# Altium schematic sheet Keyboard_Joy.SchDoc
size A4
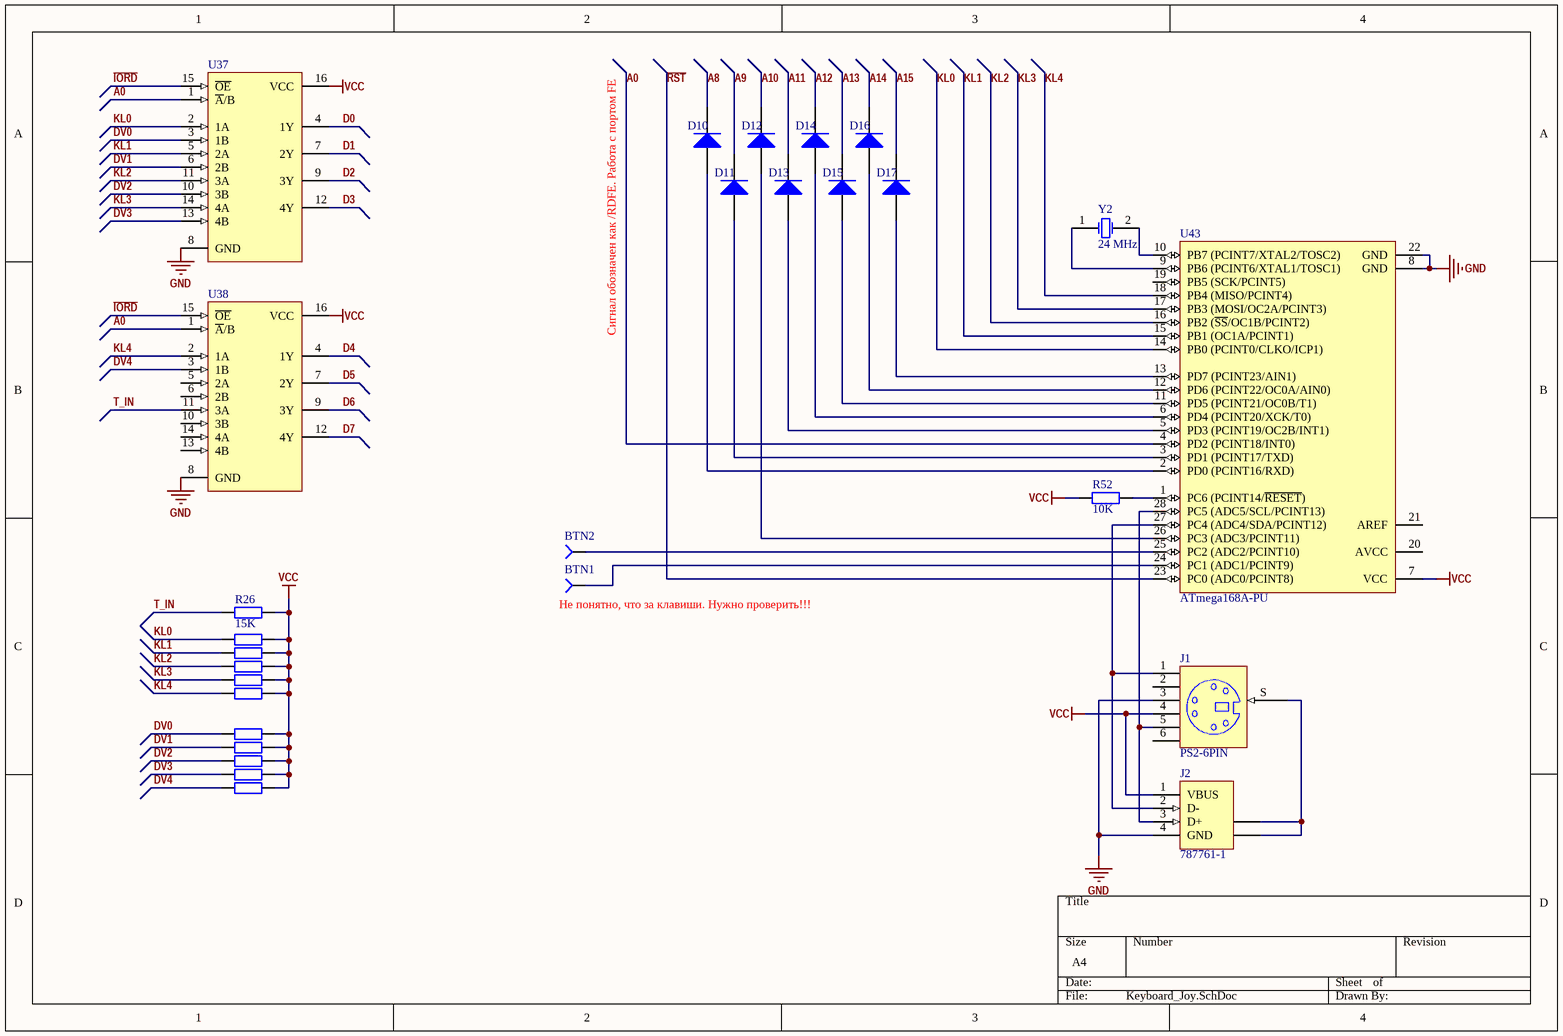
[diagram p0: Keyboard_Joy.SchDoc]

## Parts
BTN1  Socket  [PIN1]  (value not drawn)
BTN2  Socket  [PIN1]  (value not drawn)
D10  Diode 1N4148  [DO-35]  (value not drawn)
D11  Diode 1N4148  [DO-35]  (value not drawn)
D12  Diode 1N4148  [DO-35]  (value not drawn)
D13  Diode 1N4148  [DO-35]  (value not drawn)
D14  Diode 1N4148  [DO-35]  (value not drawn)
D15  Diode 1N4148  [DO-35]  (value not drawn)
D16  Diode 1N4148  [DO-35]  (value not drawn)
D17  Diode 1N4148  [DO-35]  (value not drawn)
J1  PS2-6PIN  [PS2-6PIN]
J2  787761-1  [787761]
R26  value 15K  [AXIAL-0.4]  (hidden comment: Res2)
R27  Res2  [AXIAL-0.4]  (value not drawn)
R28  Res2  [AXIAL-0.4]  (value not drawn)
R29  Res2  [AXIAL-0.4]  (value not drawn)
R30  Res2  [AXIAL-0.4]  (value not drawn)
R33  Res2  [AXIAL-0.4]  (value not drawn)
R36  Res2  [AXIAL-0.4]  (value not drawn)
R38  Res2  [AXIAL-0.4]  (value not drawn)
R40  Res2  [AXIAL-0.4]  (value not drawn)
R42  Res2  [AXIAL-0.4]  (value not drawn)
R44  Res2  [AXIAL-0.4]  (value not drawn)
R52  value 10K  [AXIAL-0.4]  (hidden comment: Res2)
U37  (no value)  [N016]
U38  (no value)  [N016]
U43  ATmega168A-PU  [28P3]
Y2  24 MHz  [HC25U]

## Nets
GND: J1.3 J2.4(GND) U37.8(GND) U38.8(GND) U43.8(GND) U43.22(GND)
VCC: J1.4 J2.1(VBUS) R26.2 R27.2 R28.2 R29.2 R30.2 R33.2 R36.2 R38.2 R40.2 R42.2 R44.2 R52.2 U37.16(VCC) U38.16(VCC) U43.7(VCC)
A0: U37.1(~{A}/B) U38.1(~{A}/B) U43.4(PD2_(PCINT18/INT0))
A8: D10.2(K)
A9: D11.2(K)
A10: D12.2(K)
A11: D13.2(K)
A12: D14.2(K)
A13: D15.2(K)
A14: D16.2(K)
A15: D17.2(K)
D0: U37.4(1Y)
D1: U37.7(2Y)
D2: U37.9(3Y)
D3: U37.12(4Y)
D4: U38.4(1Y)
D5: U38.7(2Y)
D6: U38.9(3Y)
D7: U38.12(4Y)
DV0: R36.1 U37.3(1B)
DV1: R38.1 U37.6(2B)
DV2: R40.1 U37.10(3B)
DV3: R42.1 U37.13(4B)
DV4: R44.1 U38.3(1B)
~{IORD}: U37.15(~{OE}) U38.15(~{OE})
KL0: R27.1 U37.2(1A) U43.14(PB0_(PCINT0/CLKO/ICP1))
KL1: R28.1 U37.5(2A) U43.15(PB1_(OC1A/PCINT1))
KL2: R29.1 U37.11(3A) U43.16(PB2_(~{SS}/OC1B/PCINT2))
KL3: R30.1 U37.14(4A) U43.17(PB3_(MOSI/OC2A/PCINT3))
KL4: R33.1 U38.2(1A) U43.18(PB4_(MISO/PCINT4))
~{RST}: U43.23(PC0_(ADC0/PCINT8))
T_IN: R26.1 U38.11(3A)
NetBTN1_1: BTN1.1 U43.24(PC1_(ADC1/PCINT9))
NetBTN2_1: BTN2.1 U43.25(PC2_(ADC2/PCINT10))
NetD10_1: D10.1(A) U43.2(PD0_(PCINT16/RXD))
NetD11_1: D11.1(A) U43.3(PD1_(PCINT17/TXD))
NetD12_1: D12.1(A) U43.26(PC3_(ADC3/PCINT11))
NetD13_1: D13.1(A) U43.5(PD3_(PCINT19/OC2B/INT1))
NetD14_1: D14.1(A) U43.6(PD4_(PCINT20/XCK/T0))
NetD15_1: D15.1(A) U43.11(PD5_(PCINT21/OC0B/T1))
NetD16_1: D16.1(A) U43.12(PD6_(PCINT22/OC0A/AIN0))
NetD17_1: D17.1(A) U43.13(PD7_(PCINT23/AIN1))
NetJ1_1: J1.1 J2.2(D-) U43.27(PC4_(ADC4/SDA/PCINT12))
NetJ1_5: J1.5 J2.3(D+) U43.28(PC5_(ADC5/SCL/PCINT13))
NetJ1_S: J1.S J2.5(SHLD) J2.6(SHLD)
NetR52_1: R52.1 U43.1(PC6_(PCINT14/~{RESET}))
NetU43_9: U43.9(PB6_(PCINT6/XTAL1/TOSC1)) Y2.1(OSC1)
NetU43_10: U43.10(PB7_(PCINT7/XTAL2/TOSC2)) Y2.2(OSC2)

Not connected (* = marked no-connect by the designer): J1 2 6; U38 5(2A) 6(2B) 10(3B) 13(4B) 14(4A); U43 19(PB5_(SCK/PCINT5)) 20(AVCC) 21(AREF)

## Notes on the sheet
- Сигнал обозначен как /RDFE. Работа с портом FE
- (near BTN1) Не понятно, что за клавиши. Нужно проверить!!!

## Library data of the parts
D10-D17 = Diode 1N4148: High Conductance Fast Diode; Published: 8-Jun-2000; LatestRevisionDate: 17-Jul-2002; LatestRevisionNote: Re-released for DXP Platform.; DatasheetVersion: 1997; PackageReference: DO-35; Publisher: Altium Limited; PackageDescription: Diode, Axial; Body 3.8 x 1.9 mm (LxDia. max), Lead Dia. 0.53 mm (max); Code_JEDEC: DO-204-AH; ComponentLink1Description: Manufacturer Link; ComponentLink1URL: http://www.fairchildsemi.com/; ComponentLink2Description: Datasheet; ComponentLink2URL: http://www.fairchildsemi.com/ds/1N%2F1N4148.pdf
J1 = PS2-6PIN: 6 Pin Through Hole PS2 Socket (Kycon P/N); Published: 17-Dec-2003; Publisher: Altium Limited; ComponentLink1Description: Manufacturer Link; ComponentLink1URL: http://www.oupiin.com/prodindx.html#Headers
J2 = 787761-1: USB 1.1, Right Angle, Thru-Hole, A Type, Receptacle, 4 Position, Black; ContactMaterial: Copper Alloy; ContactPlating: Gold Flash over Palladium Nickel or Gold (30) over Nickel; TerminationLength: 2.84mm [0.112in.]; PCB_Layout: Complies with manufacturer's recommendation.; DrillSize: Corresponds to nominal value.; PanelGround: Without; Published: 15-Jul-2004; DatasheetDocument: 11-Jan-2004; PackageDocument: 11-Jan-2004; PackageReference: 787761; Publisher: Altium Limited; HousingMaterial: Thermoplastic; ComponentLink1Description: Manufacturer Link; ComponentLink1URL: http://www.tycoelectronics.com/; ComponentLink2Description: Packaging Specification; ComponentLink2URL: http://ecommas.tycoelectronics.com/commerce/DocumentDelivery/DDEController?Action=showdoc&DocId=Customer+Drawing%7F787761%7FH%7Ftif%7FEnglish%7FENG_CD_787761_H.tif
R26 R52 = Res2: Resistor; Published: 8-Jun-2000; LatestRevisionDate: 17-Jul-2002; LatestRevisionNote: Re-released for DXP Platform.; PackageReference: AXIAL-0.4; Publisher: Altium Limited; PackageDescription: Axial Device, Thru-Hole; 2 Leads; 0.4 in Pin Spacing
R27-R30 R33 R36 R38 R40 R42 R44 = Res2: Resistor; Value: 15K; Published: 8-Jun-2000; LatestRevisionDate: 17-Jul-2002; LatestRevisionNote: Re-released for DXP Platform.; PackageReference: AXIAL-0.4; Publisher: Altium Limited; PackageDescription: Axial Device, Thru-Hole; 2 Leads; 0.4 in Pin Spacing
U37 U38 = SN74HC257N: Quadruple 2-Line to 1-Line Data Selector/Multiplexer with 3-State Outputs; Published: 8-Jun-2000; LatestRevisionDate: 04-Mar-2005; LatestRevisionNote: Stylized 3D Model Added.; DatasheetVersion: Jun-1989; PackageVersion: Oct-1995; PackageReference: N016; Publisher: Altium Limited; PackageDescription: DIP; 16 Leads; Row Spacing 7.62 mm; Pitch 2.54 mm; Code_JEDEC: MS-001-BB; ComponentLink1Description: Manufacturer Link; ComponentLink1URL: http://www.ti.com/; ComponentLink2Description: Datasheet; ComponentLink2URL: http://www-s.ti.com/sc/ds/sn74hc257.pdf
U43 = ATmega168A-PU: 8-bit AVR Microcontroller, 16KB Flash, 512 Bytes EEPROM, 1KB SRAM, 28-pin PDIP, Industrial Grade (-40°C to 85°C); Published: 1-Apr-2010; DatasheetVersion: revA, Jan-2010; PackageVersion: revB, Sep-2001; PackageReference: 28P3; Publisher: Altium Limited; PackageDescription: 28-lead (0.300"/7.62mm Wide) Plastic Dual Inline Package (PDIP); Supplier 1: Digi-Key; Supplier Part Number 1: ATMEGA168A-PU-ND; Supplier 2: Mouser; Supplier Part Number 2: 556-ATMEGA168A-PU; ComponentLink1Description: Manufacturer Link; ComponentLink1URL: http://www.atmel.com/products/avr/default.asp?; ComponentLink2Description: ATmega48A/48PA/88A/88PA/168A/168PA/328/328P Datasheet; ComponentLink2URL: http://www.atmel.com/dyn/resources/prod_documents/8271.pdf; ComponentLink3Description: ATmega48A/48PA/88A/88PA/168A/168PA/328/328P Summary; ComponentLink3URL: http://www.atmel.com/dyn/resources/prod_documents/8271S.pdf; ComponentLink4Description: Atmel.com Home; ComponentLink4URL: http://www.atmel.com
Y2 = XTAL: Crystal Oscillator; Published: 8-Jun-2000; LatestRevisionDate: 17-Jul-2002; LatestRevisionNote: Re-released for DXP Platform.; PackageReference: R38; Publisher: Altium Limited; PackageDescription: Crystal, Thru-Hole; 2 Leads; Body 3.1 x 8.2 mm (Dia.xH)
BTN1 BTN2 = Socket: LatestRevisionDate: 17-Jul-2002; LatestRevisionNote: Re-released for DXP Platform.; Publisher: Altium Limited